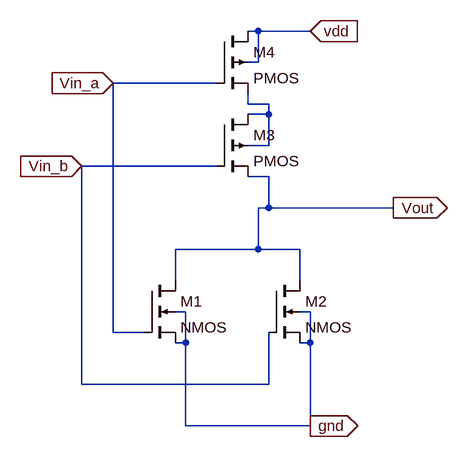
[diagram p0: schematic nor_cos.asc]
nor_cos.asc, the LTspice schematic file:
Version 4
SHEET 1 880 680
WIRE 368 -208 352 -208
WIRE 448 -208 368 -208
WIRE 368 -160 368 -208
WIRE 368 -160 352 -160
WIRE 304 -128 144 -128
WIRE 352 -96 352 -112
WIRE 384 -96 352 -96
WIRE 384 -80 384 -96
WIRE 384 -80 352 -80
WIRE 384 -32 384 -80
WIRE 384 -32 352 -32
WIRE 304 0 96 0
WIRE 384 16 352 16
WIRE 384 64 384 16
WIRE 384 64 368 64
WIRE 576 64 384 64
WIRE 368 128 368 64
WIRE 368 128 240 128
WIRE 432 128 368 128
WIRE 240 176 240 128
WIRE 432 176 432 128
WIRE 256 224 240 224
WIRE 448 224 432 224
WIRE 144 256 144 -128
WIRE 192 256 144 256
WIRE 256 272 256 224
WIRE 256 272 240 272
WIRE 448 272 448 224
WIRE 448 272 432 272
WIRE 96 336 96 0
WIRE 384 336 384 256
WIRE 384 336 96 336
WIRE 256 400 256 272
WIRE 448 400 448 272
WIRE 448 400 256 400
FLAG 144 -128 Vin_a
IOPIN 144 -128 In
FLAG 96 0 Vin_b
IOPIN 96 0 In
FLAG 448 400 gnd
IOPIN 448 400 Out
FLAG 448 -208 vdd
IOPIN 448 -208 In
FLAG 576 64 Vout
IOPIN 576 64 Out
SYMBOL nmos4 192 176 R0
SYMATTR InstName M1
SYMATTR Value2 l=180nm w=270nm
SYMBOL nmos4 384 176 R0
SYMATTR InstName M2
SYMATTR Value2 l=180nm w=270nm
SYMBOL pmos4 304 -208 R0
SYMATTR InstName M4
SYMATTR Value2 l=180nm w=810nm
SYMBOL pmos4 304 -80 R0
SYMATTR InstName M3
SYMATTR Value2 l=180nm w=810nm

The netlist it stands for:
* nor_cos.asc
M1 Vout Vin_a gnd gnd NMOS l=180nm w=270nm
M2 Vout Vin_b gnd gnd NMOS l=180nm w=270nm
M4 vdd Vin_a N001 vdd PMOS l=180nm w=810nm
M3 N001 Vin_b Vout N001 PMOS l=180nm w=810nm
.model NMOS NMOS
.model PMOS PMOS
.lib standard.mos
.backanno
.end